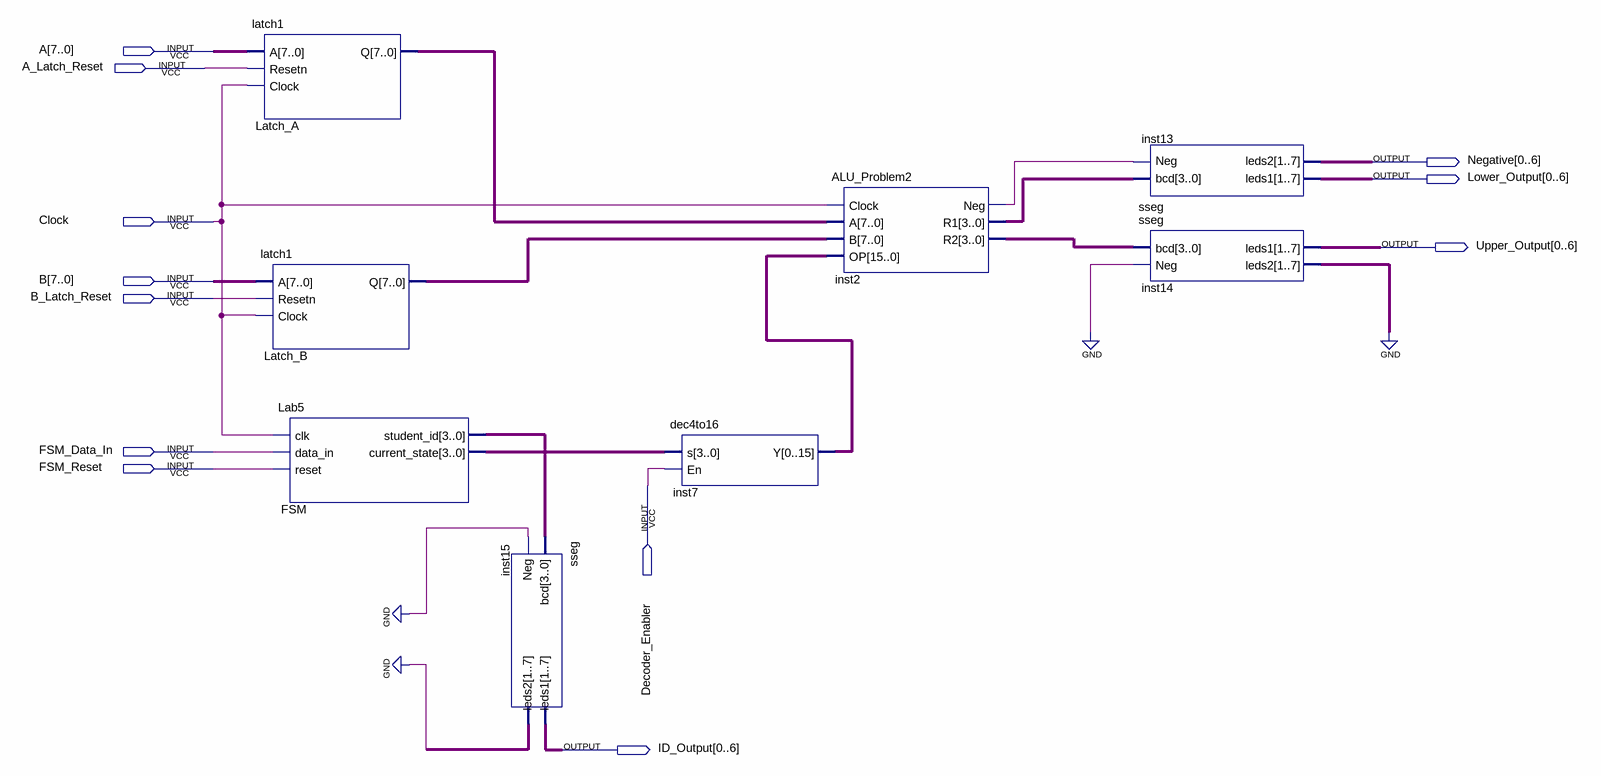
[diagram p0: schematic sheet]
// Quartus schematic Lab6V3.bdf as structural Verilog: 8 symbols, 12 pins
module Lab6V3 (
  input  [7:0] A,
  input  A_Latch_Reset,
  input  Clock,
  input  [7:0] B,
  input  B_Latch_Reset,
  input  FSM_Data_In,
  input  FSM_Reset,
  input  Decoder_Enabler,
  output [0:6] Negative,
  output [0:6] Lower_Output,
  output [0:6] Upper_Output,
  output [0:6] ID_Output
);

  wire inst2_neg;
  wire [3:0] FSM_current_state, FSM_student_id, inst2_r1, inst2_r2;
  wire [6:0] inst14_leds2, inst15_leds2;
  wire [7:0] Latch_A_q, Latch_B_q;
  wire [15:0] inst7_y;

  latch1 Latch_A (.A(A), .Resetn(A_Latch_Reset), .Clock(Clock), .Q(Latch_A_q));
  latch1 Latch_B (.A(B), .Resetn(B_Latch_Reset), .Clock(Clock), .Q(Latch_B_q));
  Lab5 FSM (
    .clk(Clock), .data_in(FSM_Data_In), .reset(FSM_Reset), .student_id(FSM_student_id),
    .current_state(FSM_current_state));
  sseg inst15 (.bcd(FSM_student_id), .Neg(1'b0), .leds1(ID_Output), .leds2(inst15_leds2));
  dec4to16 inst7 (.s(FSM_current_state), .En(Decoder_Enabler), .Y(inst7_y));
  ALU_Problem2 inst2 (
    .Clock(Clock), .A(Latch_A_q), .B(Latch_B_q), .OP(inst7_y), .Neg(inst2_neg), .R1(inst2_r1), .R2(inst2_r2));
  sseg inst13 (.bcd(inst2_r1), .Neg(inst2_neg), .leds1(Lower_Output), .leds2(Negative));
  sseg inst14 (.bcd(inst2_r2), .Neg(1'b0), .leds1(Upper_Output), .leds2(inst14_leds2));
  // also tied to GND on the sheet: {inst14_leds2[0], inst14_leds2[1], inst14_leds2[2], inst14_leds2[3], inst14_leds2[4], inst14_leds2[5], inst14_leds2[6]}
endmodule
